# EAGLE design atmel-7-segment-rtc (EAGLE 7.5.0)
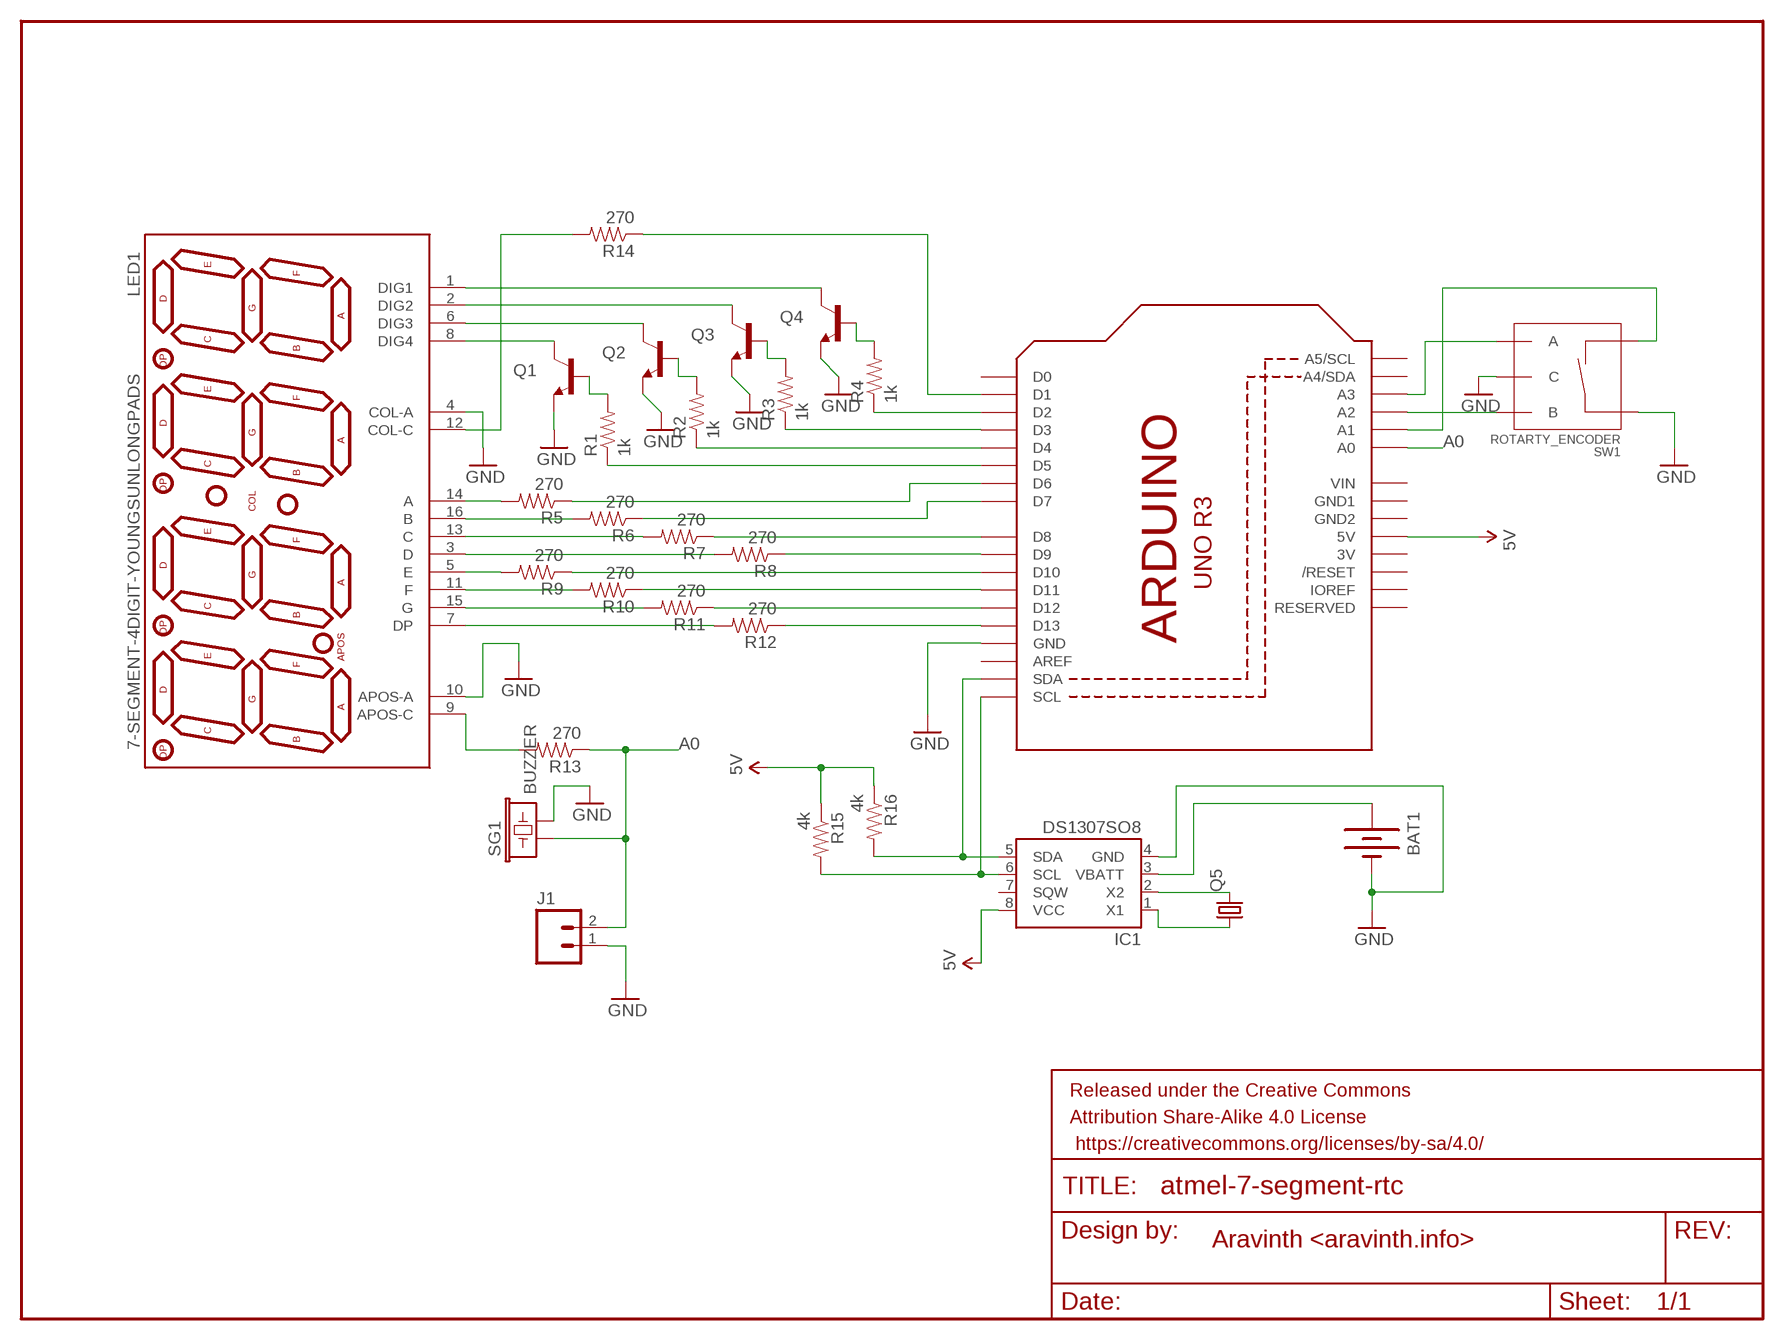
[diagram p0: schematic, sheet 1]

## Parts
ARDUINO  ARDUINOR3-DIMENSION  [ARDUINOR3]
BAT1  BATTERY12MM  [BATTCON_12MM]
FRAME1  FRAME-LETTER  [CREATIVE_COMMONS]
IC1  DS1307SO8  [SO08]
J1  M023.5MM  [SCREWTERMINAL-3.5MM-2]
LED1  7-SEGMENT-4DIGIT-YOUNGSUNLONGPADS  [7-SEGMENT-4DIGIT-YOUNGSUN-LONGPADS]
Q1  TRANSISTOR_NPNMMBT2222A  [SOT23-3]
Q2  TRANSISTOR_NPNMMBT2222A  [SOT23-3]
Q3  TRANSISTOR_NPNMMBT2222A  [SOT23-3]
Q4  TRANSISTOR_NPNMMBT2222A  [SOT23-3]
Q5  CRYSTALTC26H  [TC26H]
R1  1k  RESISTOR0805-RES  [0805]
R2  1k  RESISTOR0805-RES  [0805]
R3  1k  RESISTOR0805-RES  [0805]
R4  1k  RESISTOR0805-RES  [0805]
R5  270  RESISTOR0805-RES  [0805]
R6  270  RESISTOR0805-RES  [0805]
R7  270  RESISTOR0805-RES  [0805]
R8  270  RESISTOR0805-RES  [0805]
R9  270  RESISTOR0805-RES  [0805]
R10  270  RESISTOR0805-RES  [0805]
R11  270  RESISTOR0805-RES  [0805]
R12  270  RESISTOR0805-RES  [0805]
R13  270  RESISTOR0805-RES  [0805]
R14  270  RESISTOR0805-RES  [0805]
R15  4k  RESISTOR0805-RES  [0805]
R16  4k  RESISTOR0805-RES  [0805]
SG1  BUZZER  BUZZERNS  [BUZZER-12MM-NS]
SW1  ROTARTY_ENCODER  [ROTARY_ENC_PLAIN]

## Nets
5V [power]: ARDUINO.5V IC1.8(VCC) R15.1 R16.1
A0: ARDUINO.A0 J1.2 R13.1 SG1.+
GND [power]: ARDUINO.GND BAT1.GND(-) IC1.4(GND) J1.1 LED1.4(COL-A) LED1.10(APOS-A) Q1.2(E) Q2.2(E) Q3.2(E) Q4.2(E) SG1.- SW1.C SW1.SW+
N$1: ARDUINO.D5 R1.1
N$2: Q1.1(B) R1.2
N$3: Q2.1(B) R2.2
N$4: Q3.1(B) R3.2
N$5: LED1.8(DIG4) Q1.3(C)
N$6: LED1.6(DIG3) Q2.3(C)
N$7: LED1.2(DIG2) Q3.3(C)
N$8: LED1.1(DIG1) Q4.3(C)
N$9: Q4.1(B) R4.2
N$10: ARDUINO.D2 R4.1
N$11: ARDUINO.D3 R3.1
N$12: ARDUINO.D4 R2.1
N$13: LED1.12(COL-C) R14.2
N$14: ARDUINO.D1 R14.1
N$15: LED1.14(A) R5.2
N$16: LED1.16(B) R6.2
N$17: LED1.13(C) R7.2
N$18: LED1.3(D) R8.2
N$19: LED1.5(E) R9.2
N$20: LED1.11(F) R10.2
N$21: LED1.15(G) R11.2
N$22: LED1.7(DP) R12.2
N$23: ARDUINO.D6 R5.1
N$24: ARDUINO.D7 R6.1
N$25: ARDUINO.D8 R7.1
N$26: ARDUINO.D9 R8.1
N$27: ARDUINO.D10 R9.1
N$28: ARDUINO.D11 R10.1
N$29: ARDUINO.D12 R11.1
N$30: ARDUINO.D13 R12.1
N$31: ARDUINO.SDA IC1.5(SDA) R16.2
N$32: LED1.9(APOS-C) R13.2
N$34: ARDUINO.SCL IC1.6(SCL) R15.2
N$35: ARDUINO.A2 SW1.B
N$36: IC1.2(X2) Q5.2
N$37: IC1.1(X1) Q5.1
N$38: BAT1.PWR@1(+) IC1.3(VBATT)
N$39: ARDUINO.A1 SW1.SW-
N$40: ARDUINO.A3 SW1.A
Unconnected: ARDUINO.A4(A4/SDA) ARDUINO.A5(A5/SCL) ARDUINO.AREF ARDUINO.D0 ARDUINO.IOREF ARDUINO.RESERVED ARDUINO.RESET(/RESET) IC1.7(SQW)

## Notes on the sheet
- Aravinth <aravinth.info>

## Power pins joined to a net without a drawn wire
3V: ARDUINO.3V
GND1: ARDUINO.GND1
GND2: ARDUINO.GND2
VIN: ARDUINO.VIN

## Library data of the parts
ARDUINO = adafruit:ARDUINOR3: This is a new object for the new Arduino R3 - with extra pins that you may want to use (such as IOref, and duplicated A4/A5
BAT1 = SparkFun-Electromechanical:BATTERY: Battery Holders Various common sizes : AA, AAA, 18650 (PRT-12895), 20mm coin cell and 12mm coin cell. 20MM_4LEGS, BATT-10373; PROD_ID: BATT-08044
FRAME1 = SparkFun-Aesthetics:FRAME-LETTER: Schematic Frame Standard 8.5x11 US Letter frame
IC1 = SparkFun-FreqCtrl:DS1307: I2C real-time clock with battery backup.
J1 = SparkFun-Connectors:M02: Standard 2-pin 0.1" header. Use with - straight break away headers ( PRT-00116) - right angle break away headers (PRT-00553) - swiss pins (PRT-00743) - machine pins (PRT-00117) - female headers (PRT-00115) Molex polarized connector foot print use with: PRT-08233 with associated crimp pins and housings. 2.54_SCREWTERM for use with PRT-10571. 3.5mm Screw Terminal footprints for PRT-08084 5mm Screw Terminal footprints for use with PRT-08432; PROD_ID: CONN-08399
LED1 = SparkFun-Displays:7-SEGMENT-4DIGIT-YOUNGSUN: This is a part for the 4-Digit 7-segment LEDs from Young Sun. Different from the Digikey LEDs, all 16 pins are used. The LONGPADS Variant is used for a test jig, but you may like it because there is more pad to solder to. If you are concerned about routing space, the standard works just fine though.
Q1-Q4 = SparkFun-DiscreteSemi:TRANSISTOR_NPN: Generic NPN BJT MMBT2222A - TRANS-08049 (SOT-23, 1A 40V) MPSA42 - TRANS-09116 (SOT-23, 500mA 300V) MMBT5088LT1G - TRANS-11160 (SOT-23, 50 mA 30V) BC547 - COM-08928 <http://www.sparkfun.com/products/8928> (TO-92 45V 100mA) (1.Collector 2.Base 3.Emitter) 2N3904 - COM-00521 <http://www.sparkfun.com/products/521> (TO-92 40V 200mA) (1.Emitter 2.Base 3.Collector) P2N2222A - COM-12852 <http://www.sparkfun.com/products/12852> (TO-92 40V 600mA) (1.Collector 2.Base 3.Emitter); PROD_ID: TRANS-08049; VALUE: MMBT2222A
Q5 = adafruit:CRYSTAL: CRYSTAL; OC_FARNELL: unknown; OC_NEWARK: unknown
R1-R16 = SparkFun-Resistors:RESISTOR: Resistor Basic schematic elements and footprints for 0603, 1206, and PTH resistors.
SG1 = SparkFun-Electromechanical:BUZZER: Buzzer 12mm Spark Fun Electronics SKU : Comp-Buzzer
SW1 = SparkFun-Electromechanical:ROTARTY_ENCODER: Simple no LED rotary encoder Example: COM-09117

## Net classes
0 default: width 0.305 mm
1 power: width 0.61 mm

## Board
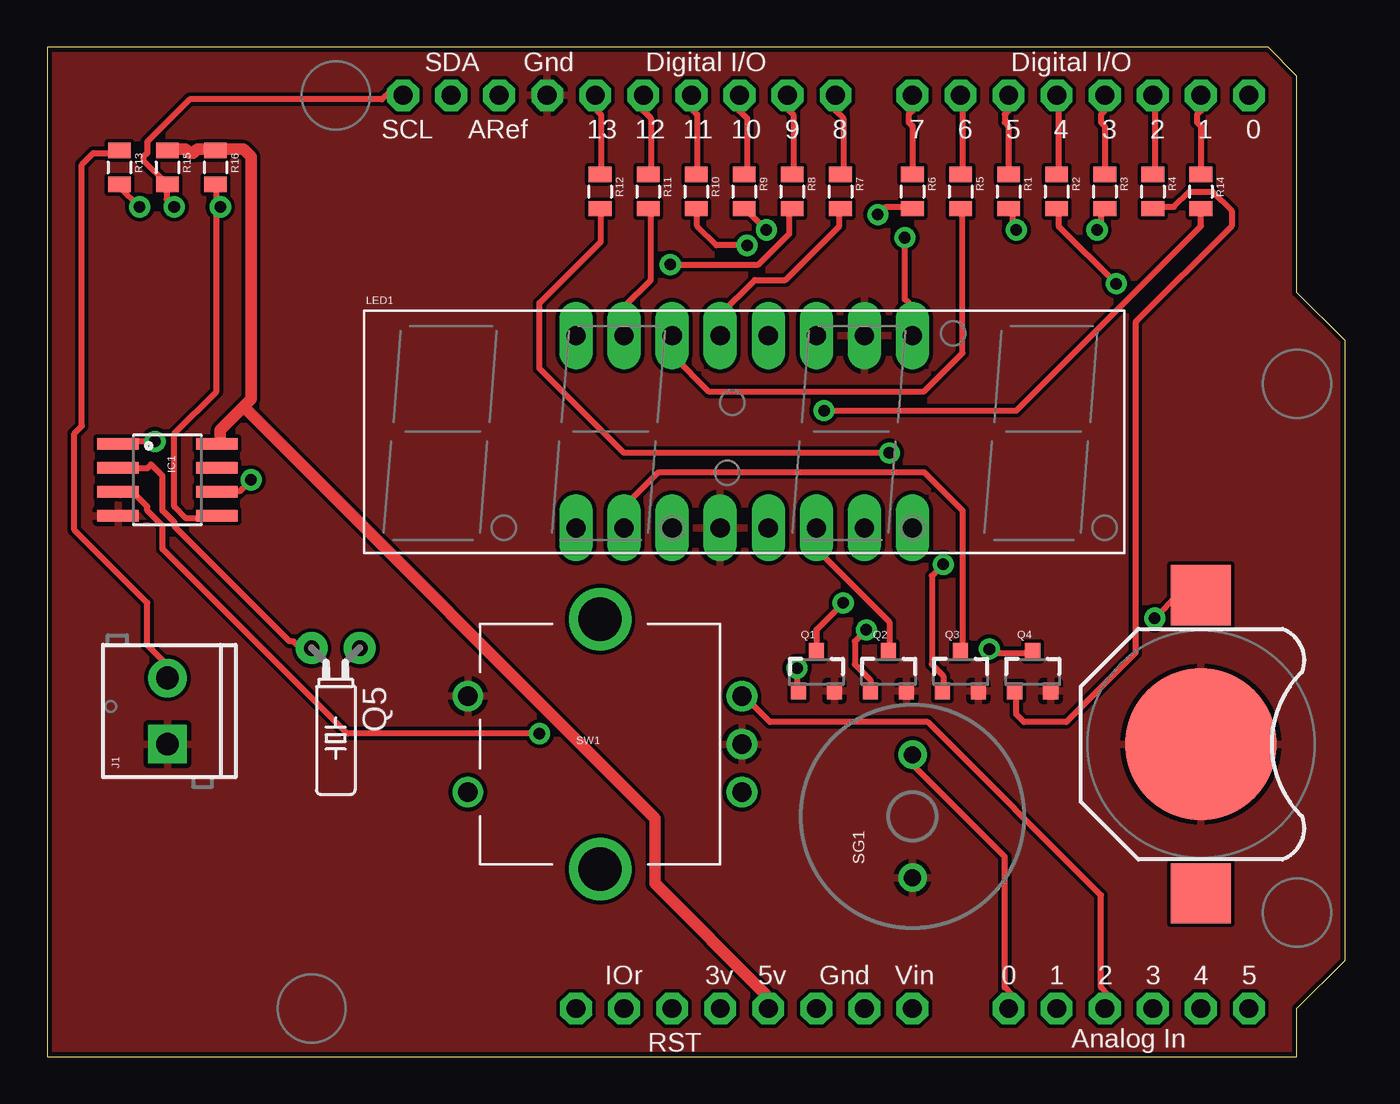
[diagram p1: board, top side]
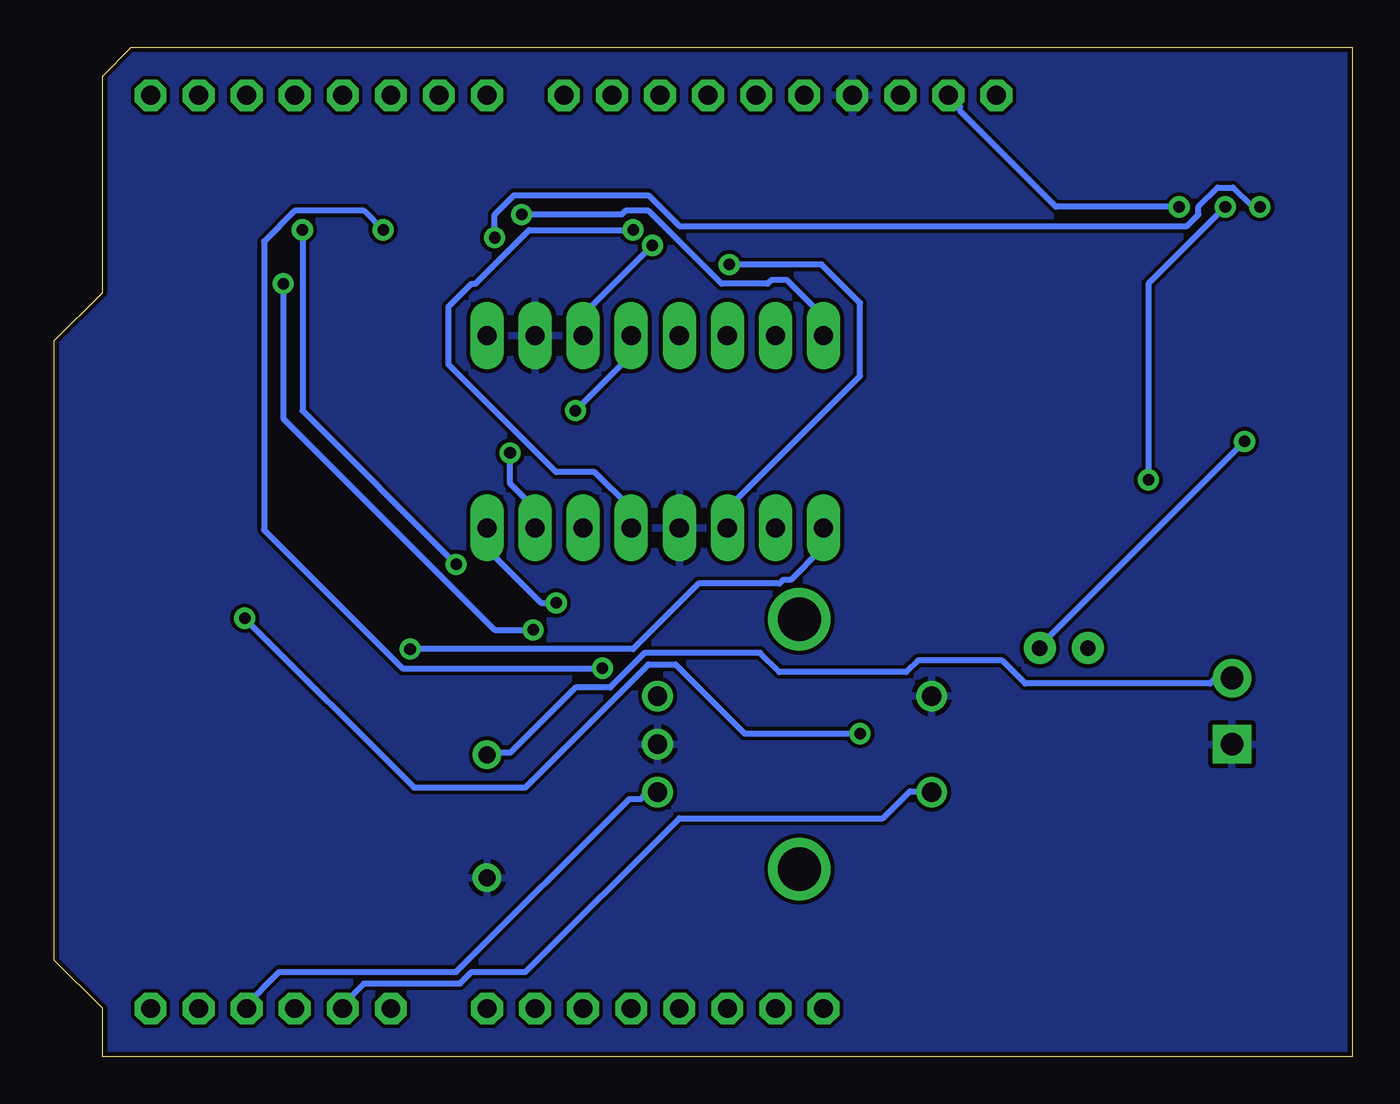
[diagram p2: board, bottom side, seen from below]

Size 68.58 x 53.34 mm. Coordinates in mm from the lower left corner, seen from the top.
Copper layers (1*16): Top 0.035mm / dielectric 1.5mm / Bottom 0.035mm
Design rules "SparkFun": minimum track width 8mil, minimum drill 20mil, track to track 8mil, track to pad 8mil, pad to pad 8mil, via to via 8mil, smd to smd 8mil, copper to edge 10mil, drill to drill 8mil, minimum pad ring 12mil, minimum via ring 10mil, stop-mask expansion 4mil, vias tented up to drill 25mil, thermal gap 10mil

### Footprints (pad centres in the part's own frame; a part is rotated, then mirrored left to right if it is on the bottom)
ARDUINOR3 = drill 1 pad 1.676 octagon: 3V 35.56,2.54; 5V 38.1,2.54; A0 50.8,2.54; A1 53.34,2.54; A2 55.88,2.54; A3 58.42,2.54; A4 60.96,2.54; A5 63.5,2.54; AREF 23.876,50.8; D0 63.5,50.8; D1 60.96,50.8; D2 58.42,50.8; D3 55.88,50.8; D4 53.34,50.8; D5 50.8,50.8; D6 48.26,50.8; D7 45.72,50.8; D8 41.656,50.8; D9 39.116,50.8; D10 36.576,50.8; D11 34.036,50.8; D12 31.496,50.8; D13 28.956,50.8; GND 26.416,50.8; GND1 43.18,2.54; GND2 40.64,2.54; IOREF 30.48,2.54; RESERVED 27.94,2.54; RESET 33.02,2.54; SCL 18.796,50.8; SDA 21.336,50.8; VIN 45.72,2.54
BATTCON_12MM = smd 8 x 8: GND 0,0 | smd 3.175 x 3.175: PWR@1 -7.874,0; PWR@2 7.874,0
SO08 = smd 0.61 x 2.21: 1 -1.905,-2.616; 2 -0.635,-2.616; 3 0.635,-2.616; 4 1.905,-2.616; 5 1.905,2.616; 6 0.635,2.616; 7 -0.635,2.616; 8 -1.905,2.616
SCREWTERMINAL-3.5MM-2 = drill 1.2 pad 2.032 square: 1 0,0 | drill 1.2 pad 2.032: 2 3.5,0
7-SEGMENT-4DIGIT-YOUNGSUN-LONGPADS = drill 1.016 pad 1.778 long: 1 -8.89,-5.08; 2 -6.35,-5.08; 3 -3.81,-5.08; 4 -1.27,-5.08; 5 1.27,-5.08; 6 3.81,-5.08; 7 6.35,-5.08; 8 8.89,-5.08; 9 8.89,5.08; 10 6.35,5.08; 11 3.81,5.08; 12 1.27,5.08; 13 -1.27,5.08; 14 -3.81,5.08; 15 -6.35,5.08; 16 -8.89,5.08
SOT23-3 = smd 0.8 x 0.9: 1 -0.95,-1; 2 0.95,-1; 3 0,1.1
TC26H = drill 0.813 pad 1.676: 1 -1.27,0; 2 1.27,0
0805 = smd 0.8 x 1.2: 1 -0.9,0; 2 0.9,0
BUZZER-12MM-NS = drill 0.9: + 3.25,0; - -3.25,0
ROTARY_ENC_PLAIN = drill 1.016: A 7.493,-2.54; B 7.493,2.54; C 7.493,0; SW+ -6.985,2.54; SW- -6.985,-2.54 | drill 2.286: P$3 0,6.604; P$4 0,-6.604

### Placement (x,y rotation side)
ARDUINO  0,0 0 top
BAT1  60.96,16.51 270 top
FRAME1  20.32,-8.89 0 top  (outside the outline)
IC1  6.35,30.48 270 top
J1  6.35,16.51 90 top
LED1  36.83,33.02 0 top
Q1  40.64,20.32 0 top
Q2  44.45,20.32 0 top
Q3  48.26,20.32 0 top
Q4  52.07,20.32 0 top
Q5  15.24,21.59 180 top
R1  50.8,45.72 270 top
R2  53.34,45.72 270 top
R3  55.88,45.72 270 top
R4  58.42,45.72 270 top
R5  48.26,45.72 270 top
R6  45.72,45.72 270 top
R7  41.91,45.72 270 top
R8  39.37,45.72 270 top
R9  36.83,45.72 270 top
R10  34.29,45.72 270 top
R11  31.75,45.72 270 top
R12  29.21,45.72 270 top
R13  3.81,46.99 270 top
R14  60.96,45.72 270 top
R15  6.35,46.99 270 top
R16  8.89,46.99 270 top
SG1  45.72,12.7 90 top
SW1  29.21,16.51 0 top

### Tracks (layer width: path | path; a pad name or v marks a point on that pad's centre or on a via)
5V
  Top 0.61: R15.1 6.5,47.95 7.32,47.95 7.52,47.75 7.72,47.75 7.92,47.95 8.74,47.95 R16.1 9.14,47.95 10.36,47.95 10.77,47.55 10.77,34.75 10.36,34.34 | 10.36,34.34 9.14,33.12 9.14,32.51 IC1.8 | 10.36,34.34 32.11,12.6 32.11,9.14 38,3.25 38,2.64 ARDUINO.5V
A0
  Top 0.305: SG1.+ 45.72,15.44 50.6,10.57 50.6,3.66 51,3.25 51,2.85 50.8,2.64 ARDUINO.A0 | R13.1 3.66,47.75 2.44,47.75 1.83,47.14 1.83,33.33 1.42,32.92 1.42,27.84 5.28,23.98 5.28,21.74 6.3,20.73 6.3,20.12 J1.2
  Bottom 0.305: SG1.+ 45.72,16.05 44.5,16.05 41.05,19.51 39.22,19.51 37.39,21.34 31.29,21.34 30.28,20.32 23.57,20.32 22.96,20.93 18.49,20.93 17.27,19.71 7.52,19.71 7.32,19.91 6.5,19.91 J1.2
GND
  pour Top: 0,53.34 0,0 66.04,0 66.04,2.54 68.58,5.08 68.58,38.1 66.04,40.64 66.04,52.07 64.77,53.34
  pour Bottom: 0,53.34 0,0 66.04,0 66.04,2.54 68.58,5.08 68.58,38.1 66.04,40.64 66.04,52.07 64.77,53.34
N$1
  Top 0.305: R1.1 50.8,49.17 50.6,49.38 50.6,49.78 50.8,49.99 ARDUINO.D5
N$2  (via drill 0.61)
  Top 0.305: v39.62,20.52 39.42,20.32 39.62,20.12 39.62,19.51 Q1.1 | v51.21,43.69 51,43.89 51,44.7 50.8,44.91 R1.2
  Bottom 0.305: v39.62,20.52 50.19,20.52 57.51,27.84 57.51,43.08 55.88,44.7 52.22,44.7 v51.21,43.69
N$3  (via drill 0.61)
  Top 0.305: v43.28,22.55 42.67,21.95 42.67,20.73 43.48,19.91 43.48,19.51 Q2.1 | v56.49,40.84 53.44,43.89 53.44,44.7 R2.2
  Bottom 0.305: v43.28,22.55 45.31,22.55 56.49,33.73 v56.49,40.84
N$4  (via drill 0.61)
  Top 0.305: v47.35,26.01 46.74,25.4 46.74,20.73 47.35,20.12 47.35,19.51 Q3.1 | v55.47,43.69 55.68,43.89 55.68,44.7 55.88,44.91 R3.2
  Bottom 0.305: v47.35,26.01 55.47,34.14 v55.47,43.69
N$5  (via drill 0.61)
  Top 0.305: Q1.3 40.64,22.55 v42.06,23.98
  Bottom 0.305: v42.06,23.98 42.88,23.98 45.72,26.82 LED1.8
N$6
  Top 0.305: LED1.6 40.64,26.82 44.5,22.96 44.5,21.54 Q2.3
N$7
  Top 0.305: LED1.2 30.48,29.06 32.31,30.89 46.33,30.89 48.36,28.85 48.36,21.54 Q3.3
N$8  (via drill 0.61)
  Top 0.305: v49.78,21.54 49.99,21.34 52.02,21.34 Q4.3
  Bottom 0.305: v49.78,21.54 38,21.54 34.54,24.99 30.28,24.99 30.07,25.2 29.67,25.2 28.04,26.82 28.04,27.84 LED1.1
N$9
  Top 0.305: Q4.1 51.21,19.3 51.21,18.09 51.61,17.68 53.85,17.68 57.51,21.34 57.51,38.81 62.59,43.89 62.59,44.7 61.57,45.72 60.35,45.72 59.54,44.91 58.52,44.91 R4.2
N$10
  Top 0.305: R4.1 58.52,46.74 58.52,50.8 ARDUINO.D2
N$11
  Top 0.305: R3.1 55.88,49.17 55.68,49.38 55.68,49.78 55.88,49.99 ARDUINO.D3
N$12
  Top 0.305: R2.1 53.44,46.74 53.44,50.8 ARDUINO.D4
N$13  (via drill 0.61)
  Top 0.305: R14.2 60.96,43.89 51.21,34.14 v41.05,34.14
  Bottom 0.305: v41.05,34.14 38.2,36.98 38.2,38 LED1.12
N$14
  Top 0.305: R14.1 60.96,49.17 60.76,49.38 60.76,49.78 60.96,49.99 ARDUINO.D1
N$15
  Top 0.305: R5.2 48.36,44.7 48.36,37.19 46.33,35.15 34.95,35.15 33.12,36.98 33.12,38 LED1.14
N$16  (via drill 0.61)
  Top 0.305: v43.89,44.5 44.3,44.91 45.72,44.91 R6.2
  Bottom 0.305: v43.89,44.5 38.61,44.5 38.41,44.7 37.19,44.7 33.33,40.84 30.89,40.84 30.68,41.05 29.87,41.05 28.04,39.22 28.04,38.2 LED1.16
N$17
  Top 0.305: LED1.13 35.56,39.22 37.39,41.05 39.01,41.05 41.86,43.89 41.86,44.7 R7.2
N$18  (via drill 0.61)
  Top 0.305: v32.92,41.86 37.59,41.86 39.22,43.48 39.22,44.7 R8.2
  Bottom 0.305: v32.92,41.86 28.04,41.86 26.01,39.83 26.01,35.97 32.92,29.06 32.92,28.04 LED1.3
N$19  (via drill 0.61)
  Top 0.305: v38,43.69 36.98,44.7 R9.2
  Bottom 0.305: v38,43.69 43.48,43.69 46.33,40.84 46.53,40.84 47.75,39.62 47.75,36.58 42.06,30.89 40.03,30.89 38.2,29.06 38.2,28.04 LED1.5
N$20  (via drill 0.61)
  Top 0.305: v36.98,42.88 35.36,42.88 34.34,43.89 34.34,44.7 R10.2
  Bottom 0.305: v36.98,42.88 40.64,39.22 LED1.11
N$21
  Top 0.305: LED1.15 30.48,39.62 31.9,41.05 31.9,44.7 R11.2
N$22  (via drill 0.61)
  Top 0.305: v44.5,31.9 30.48,31.9 26.01,36.37 26.01,39.83 29.26,43.08 29.26,44.7 R12.2
  Bottom 0.305: v44.5,31.9 44.5,30.28 43.28,29.06 43.28,28.04 LED1.7
N$23
  Top 0.305: R5.1 48.36,46.74 48.36,50.8 ARDUINO.D6
N$24
  Top 0.305: R6.1 45.72,49.17 45.52,49.38 45.52,49.78 45.72,49.99 ARDUINO.D7
N$25
  Top 0.305: ARDUINO.D8 41.66,49.99 42.06,49.58 42.06,46.74 R7.1
N$26
  Top 0.305: R8.1 39.42,46.74 39.42,49.78 39.22,49.99 39.22,50.8 ARDUINO.D9
N$27
  Top 0.305: ARDUINO.D10 36.58,49.99 36.98,49.58 36.98,46.74 R9.1
N$28
  Top 0.305: R10.1 34.34,46.74 34.34,49.78 34.14,49.99 34.14,50.8 ARDUINO.D11
N$29
  Top 0.305: ARDUINO.D12 31.5,49.99 31.9,49.58 31.9,46.74 R11.1
N$30
  Top 0.305: R12.1 29.26,46.74 29.26,49.78 29.06,49.99 29.06,50.8 ARDUINO.D13
N$31  (via drill 0.61)
  Top 0.305: 8.94,44.91 8.94,35.15 6.71,32.92 6.71,29.06 7.32,28.45 8.94,28.45 IC1.5 | 8.94,44.91 8.94,45.92 R16.2 | 8.94,44.91 v9.14,44.91
  Bottom 0.305: ARDUINO.SDA 20.73,50.19 20.73,49.99 15.65,44.91 v9.14,44.91
N$32  (via drill 0.61)
  Top 0.305: v4.88,44.91 3.86,45.92 R13.2 | v45.31,43.28 45.31,40.03 45.72,39.62 LED1.9
  Bottom 0.305: v4.88,44.91 5.28,44.91 6.3,45.92 7.11,45.92 8.13,44.91 8.13,44.5 8.74,43.89 35.56,43.89 37.19,45.52 44.3,45.52 45.31,44.5 v45.31,43.28
N$34  (via drill 0.61)
  Top 0.305: ARDUINO.SCL 18.69,50.8 18.49,51 18.09,51 17.68,50.6 7.52,50.6 5.28,48.36 5.28,47.75 5.08,47.55 5.08,47.35 6.3,46.13 R15.2 6.1,46.13 6.1,45.92 6.3,45.72 6.3,45.31 v6.71,44.91 | v10.77,30.48 10.16,29.87 9.14,29.87 IC1.6
  Bottom 0.305: v10.77,30.48 10.77,40.84 v6.71,44.91
N$35
  Top 0.305: SW1.B 36.78,18.9 36.98,18.9 38.2,17.68 46.53,17.68 55.68,8.53 55.68,3.66 56.08,3.25 56.08,2.85 55.88,2.64 ARDUINO.A2
N$36
  Top 0.305: IC1.2 3.86,31.09 5.28,31.09 5.49,31.29 6.1,30.68 6.1,28.85 6.71,28.25 6.71,28.04 12.8,21.95 13.01,21.95 13.21,21.74 13.82,21.74 Q5.2
N$37  (via drill 0.61)
  Top 0.305: v5.69,32.51 3.86,32.51 IC1.1
  Bottom 0.305: v5.69,32.51 16.46,21.74 Q5.1
N$38  (via drill 0.61)
  Top 0.305: v26.01,17.07 15.85,17.07 6.1,26.82 6.1,28.04 5.28,28.85 5.28,29.06 4.67,29.67 3.86,29.67 IC1.3 | v58.52,23.16 59.74,24.38 BAT1.PWR@1
  Bottom 0.305: v26.01,17.07 32.11,17.07 35.76,20.73 37.19,20.73 43.69,14.22 49.58,14.22 v58.52,23.16
N$39
  Bottom 0.305: SW1.SW- 22.35,14.02 23.37,14.02 24.79,12.6 35.56,12.6 43.69,4.47 46.53,4.47 47.14,3.86 52.22,3.86 53.44,2.64 ARDUINO.A1
N$40
  Bottom 0.305: SW1.A 36.78,13.82 37.39,13.82 37.59,13.61 38.2,13.61 47.35,4.47 56.69,4.47 58.52,2.64 ARDUINO.A3